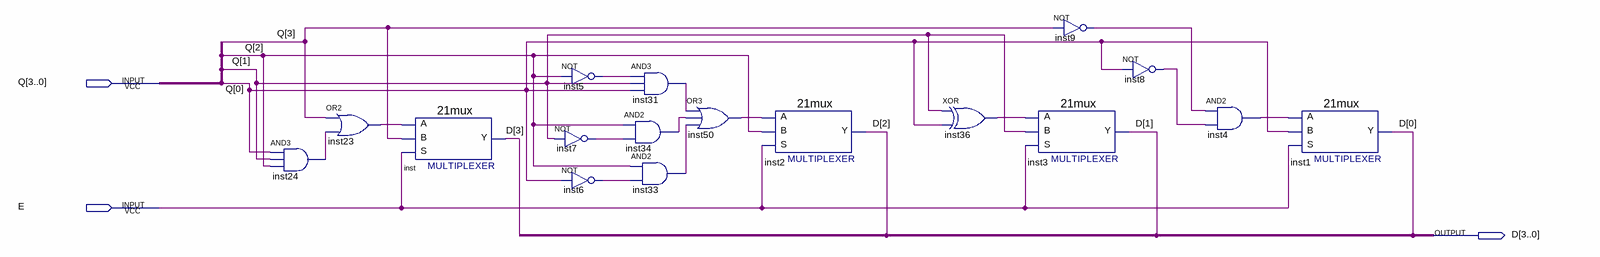
[diagram p0: schematic sheet]
// Quartus schematic CDin.bdf as structural Verilog: 17 symbols, 3 pins
module CDin (
  input  [3:0] Q,
  input  E,
  output [3:0] D
);

  wire inst4_out, inst5_out, inst6_out, inst7_out, inst8_out, inst9_out, inst23_out, inst24_out, inst31_out,
       inst33_out, inst34_out, inst36_out, inst50_out;

  and inst24 (inst24_out, Q[0], Q[1], Q[2]);
  or inst23 (inst23_out, Q[3], inst24_out);
  \21mux  inst (.S(E), .B(Q[3]), .A(inst23_out), .Y(D[3]));
  not inst5 (inst5_out, Q[2]);
  not inst7 (inst7_out, Q[1]);
  not inst6 (inst6_out, Q[0]);
  and inst31 (inst31_out, inst5_out, Q[1], Q[0]);
  and inst34 (inst34_out, Q[2], inst7_out);
  and inst33 (inst33_out, Q[2], inst6_out);
  or inst50 (inst50_out, inst31_out, inst34_out, inst33_out);
  \21mux  inst2 (.S(E), .B(Q[2]), .A(inst50_out), .Y(D[2]));
  xor inst36 (inst36_out, Q[1], Q[0]);
  not inst9 (inst9_out, Q[3]);
  \21mux  inst3 (.S(E), .B(Q[1]), .A(inst36_out), .Y(D[1]));
  not inst8 (inst8_out, Q[0]);
  and inst4 (inst4_out, inst9_out, inst8_out);
  \21mux  inst1 (.S(E), .B(Q[0]), .A(inst4_out), .Y(D[0]));
endmodule
